# EAGLE design Schaltplan_SMD2 (EAGLE 8.2.2)
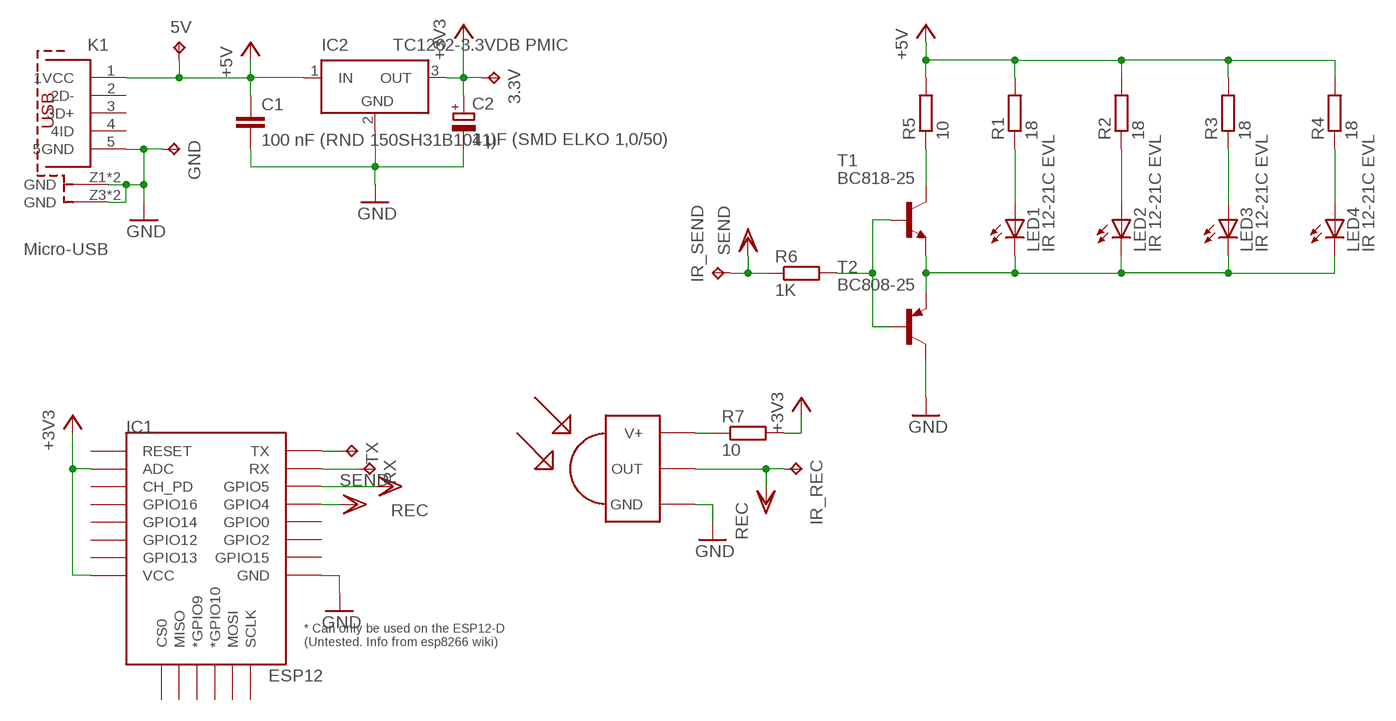
[diagram p0: schematic, sheet 1]

## Parts
3.3V  TPB2,54  [B2,54]
5V  TPB2,54  [B2,54]
C1  100 nF (RND 150SH31B1041)  C-EUC1206  [C1206]
C2  1 µF (SMD ELKO 1,0/50)  CPOL-EUUD-4X5,8  [UD-4X5,8_NICHICON]
GND  TPB2,54  [B2,54]
IC1  ESP12  ESP12ESMD  [ESP12E-SMD]
IC2  TC1262-3.3VDB PMIC  LT1129CST5  [SOT223]
IR-TRANSMITTER  TSOP1833  [TSOP18XX]
IR_REC  TPB2,54  [B2,54]
IR_SEND  TPB2,54  [B2,54]
K1  Micro-USB  629105150521  [629105150521]
LED1  IR 12-21C EVL  LEDCHIPLED_1206  [CHIPLED_1206]
LED2  IR 12-21C EVL  LEDCHIPLED_1206  [CHIPLED_1206]
LED3  IR 12-21C EVL  LEDCHIPLED_1206  [CHIPLED_1206]
LED4  IR 12-21C EVL  LEDCHIPLED_1206  [CHIPLED_1206]
R1  18  R-EU_R1206W  [R1206W]
R2  18  R-EU_R1206W  [R1206W]
R3  18  R-EU_R1206W  [R1206W]
R4  18  R-EU_R1206W  [R1206W]
R5  10  R-EU_R1206W  [R1206W]
R6  1K  R-EU_R1206W  [R1206W]
R7  10  R-EU_R1206W  [R1206W]
RX  TPB2,54  [B2,54]
T1  BC818-25  BC818-25SMD  [SOT23-BEC]
T2  BC808-25  BC808-25SMD  [SOT23-BEC]
TX  TPB2,54  [B2,54]

## Nets
+3V3: 3.3V.TP C2.+ IC1.ADC IC1.VCC IC2.3(OUT) R7.2
+3V3T: IR-TRANSMITTER.VCC(V+) R7.1
+5V: 5V.TP C1.1 IC2.1(IN) K1.1(1VCC) R1.2 R2.2 R3.2 R4.2 R5.2
+5VT1: LED1.A R1.1
+5VT2: LED2.A R2.1
+5VT3: LED3.A R3.1
+5VT4: LED4.A R4.1
+5VT5: R5.1 T1.C
GND: C1.2 C2.- GND.TP IC1.GND IC2.2(GND) IR-TRANSMITTER.GND K1.5(5GND) K1.Z1(GND) K1.Z2(GND) K1.Z3(GND) K1.Z4(GND) T2.C
IR_REC: IC1.GPIO5 IR-TRANSMITTER.OUT IR_REC.TP ; supply symbol labelled REC
IR_SEND: IC1.GPIO4 IR_SEND.TP R6.1 ; supply symbol labelled SEND
N$2: R6.2 T1.B T2.B
RX: IC1.RXD0(RX) RX.TP
SWITCHED: LED1.C LED2.C LED3.C LED4.C T1.E T2.E
TX: IC1.TXD0(TX) TX.TP
Unconnected: IC1.CH_PD IC1.CS0 IC1.GPIO0 IC1.GPIO2 IC1.GPIO9(*GPIO9) IC1.GPIO10(*GPIO10) IC1.GPIO12 IC1.GPIO13 IC1.GPIO14 IC1.GPIO15 IC1.GPIO16 IC1.MISO IC1.MOSI IC1.RESET IC1.SCLK K1.2(2D-) K1.3(3D+) K1.4(4ID)

## Power pins joined to a net without a drawn wire
GND: IC2.4(GND)

## Library data of the parts
3.3V 5V GND IR_REC IR_SEND RX TX = testpad:TP: Test pad
C1 = rcl:C-EU: CAPACITOR, European symbol
C2 = rcl:CPOL-EU: POLARIZED CAPACITOR, European symbol
IC1 = esp8266modules:ESP12E: ESP12E Module
IC2 = linear-technology:LT1129CST5: VOLTAGE REGULATOR with shutdown; MPN: LT1129CST-5#PBF; OC_FARNELL: 1663375; OC_NEWARK: 57M2069
IR-TRANSMITTER = tsop:TSOP1833: IR Receiver and Demodulator
K1 = Wurth_Elektronik_Electromechanic_Input-Output_Connectors_rev15c:629105150521: WR-COM_USB_Micro Type B_Horizontal_SMT ; Micro Type B Horizontal SMT - 3A current at Pin1 & Pin 5 - with Pegs and THT shielding Pins - T&R Packaging Code : Con_I-O_COM_USB_2.0_B_629105150521_629105150521 <http://katalog.we-online.de/media/images/eican/Con_I-O_COM_USB_2.0_B_629105150521_pf2.jpg> Details see: http://katalog.we-online.de/em/datasheet/629105150521.pdf Created 12/08/2014, Dan Xu 2014 (C) Wurth Elektronik
LED1-LED4 = led:LED: LED OSRAM: - CHIPLED LG R971, LG N971, LY N971, LG Q971, LY Q971, LO R971, LY R971 LH N974, LH R974 LS Q976, LO Q976, LY Q976 LO Q996 - Hyper CHIPLED LW Q18S LB Q993, LB Q99A, LB R99A - SideLED LS A670, LO A670, LY A670, LG A670, LP A670 LB A673, LV A673, LT A673, LW A673 LH A674 LY A675 LS A676, LA A676, LO A676, LY A676, LW A676 LS A679, LY A679, LG A679 - Hyper Micro SIDELED® LS Y876, LA Y876, LO Y876, LY Y876 LT Y87S - SmartLED LW L88C, LW L88S LB L89C, LB L89S, LG L890 LS L89K, LO L89K, LY L89K LS L896, LA L896, LO L896, LY L896 - TOPLED LS T670, LO T670, LY T670, LG T670, LP T670 LSG T670, LSP T670, LSY T670, LOP T670, LYG T670 LG T671, LOG T671, LSG T671 LB T673, LV T673, LT T673, LW T673 LH T674 LS T676, LA T676, LO T676, LY T676, LB T676, LH T676, LSB T676, LW T676 LB T67C, LV T67C, LT T67C, LS T67K, LO T67K, LY T67K, LW E67C LS E67B, LA E67B, LO E67B, LY E67B, LB E67C, LV E67C, LT E67C LW T67C LS T679, LY T679, LG T679 LS T770, LO T770, LY T770, LG T770, LP T770 LB T773, LV T773, LT T773, LW T773 LH T774 LS E675, LA E675, LY E675, LS T675 LS T776, LA T776, LO T776, LY T776, LB T776 LHGB T686 LT T68C, LB T68C - Hyper Mini TOPLED® LB M676 - Mini TOPLED Santana® LG M470 LS M47K, LO M47K, LY M47K Source: http://www.osram.convergy.de LUXEON: - LUMILED® LXK2-PW12-R00, LXK2-PW12-S00, LXK2-PW14-U00, LXK2-PW14-V00 LXK2-PM12-R00, LXK2-PM12-S00, LXK2-PM14-U00 LXK2-PE12-Q00, LXK2-PE12-R00, LXK2-PE12-S00, LXK2-PE14-T00, LXK2-PE14-U00 LXK2-PB12-K00, LXK2-PB12-L00, LXK2-PB12-M00, LXK2-PB14-N00, LXK2-PB14-P00, LXK2-PB14-Q00 LXK2-PR12-L00, LXK2-PR12-M00, LXK2-PR14-Q00, LXK2-PR14-R00 LXK2-PD12-Q00, LXK2-PD12-R00, LXK2-PD12-S00 LXK2-PH12-R00, LXK2-PH12-S00 LXK2-PL12-P00, LXK2-PL12-Q00, LXK2-PL12-R00 Source: www.luxeon.com KINGBRIGHT: KA-3528ASYC Source: www.kingbright.com
R1-R7 = resistor:R-EU_: RESISTOR, European symbol
T1 = transistor-npn:BC818*: NPN Transistor
T2 = transistor-pnp:BC808*: PNP Transistror

## Board
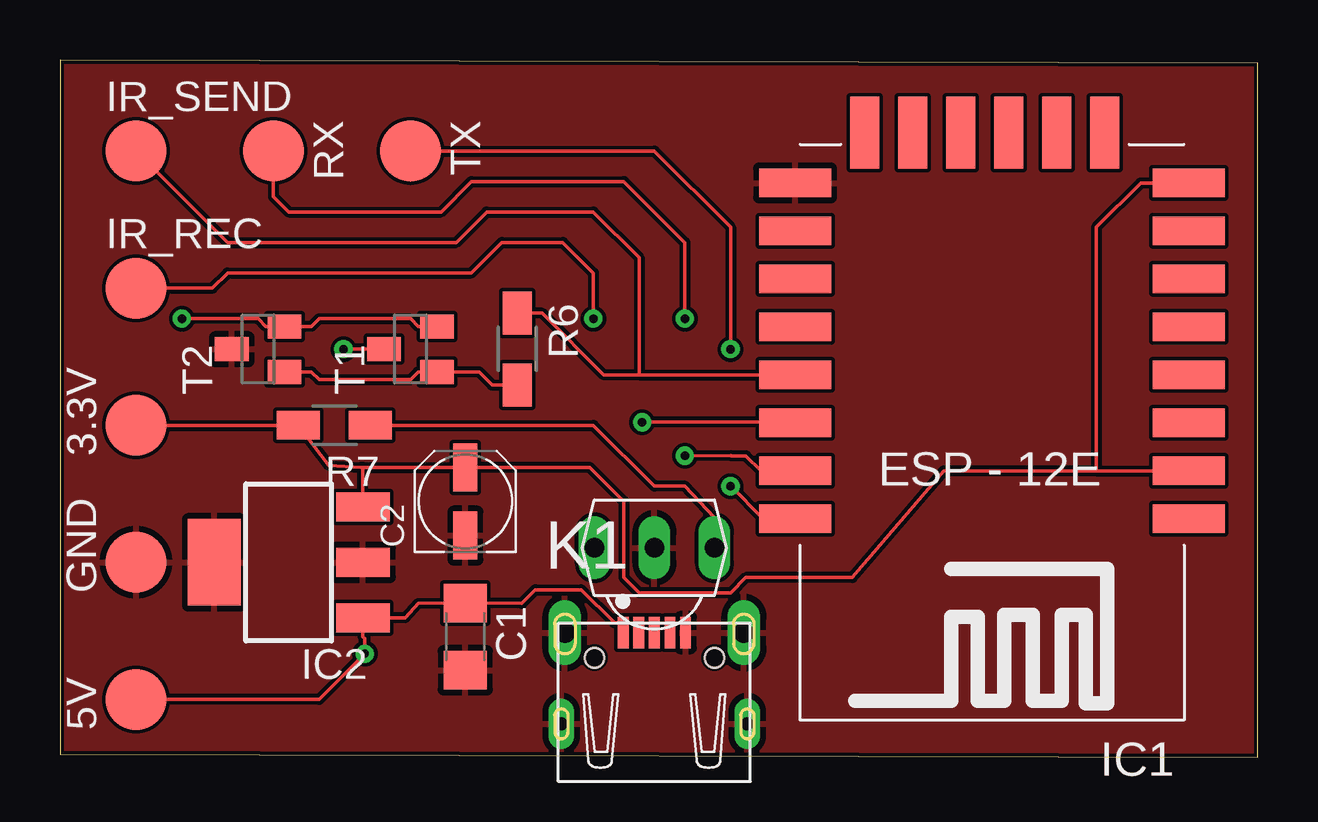
[diagram p1: board, top side]
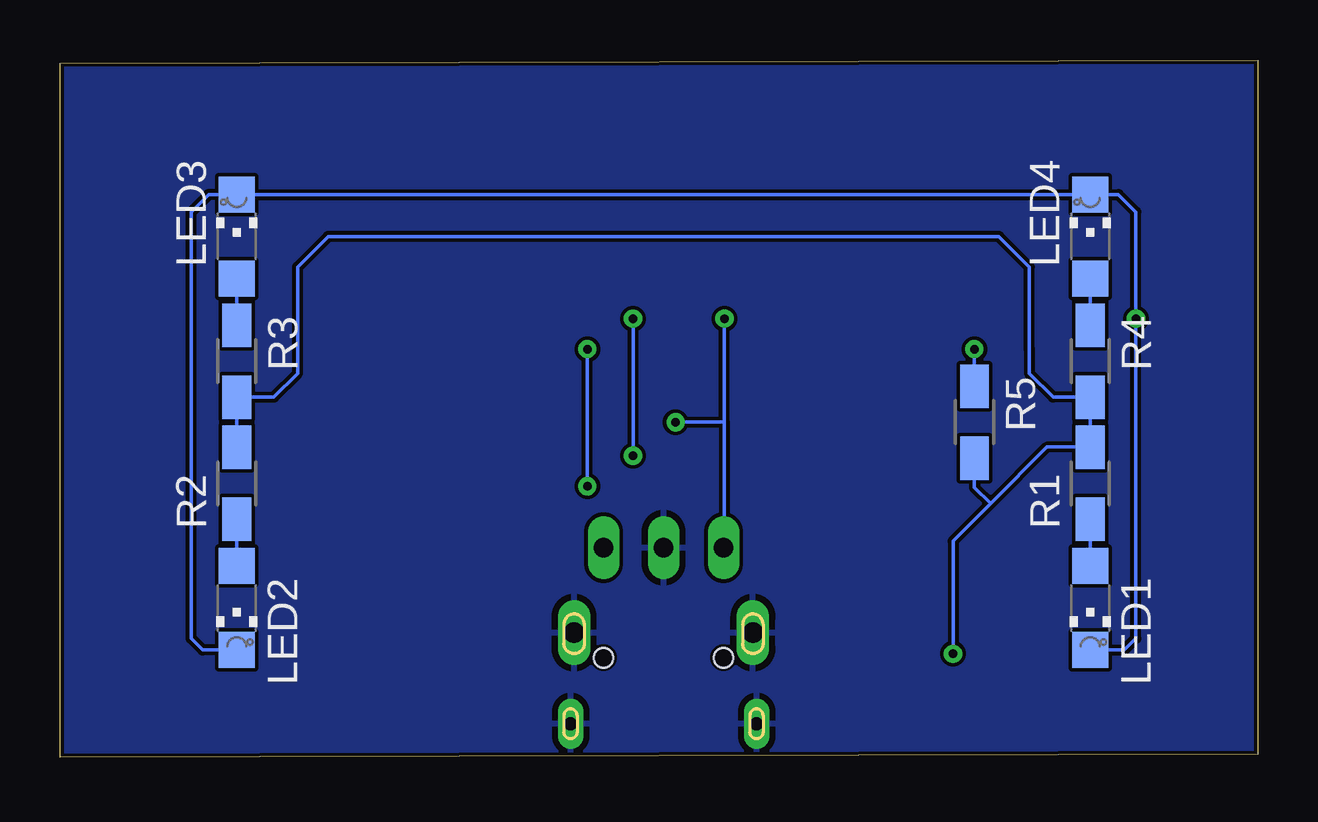
[diagram p2: board, bottom side, seen from below]

Size 49.91 x 29.07 mm. Coordinates in mm from the lower left corner, seen from the top.
Outline: 0,0.13 49.91,0 49.91,28.95 0,29.07 0,0.13
Copper layers (1*16): Top 0.035mm / dielectric 1.5mm / Bottom 0.035mm
Design rules "default *": minimum track width 6mil, minimum drill 0.35mm, track to track 6mil, track to pad 6mil, pad to pad 6mil, via to via 6mil, smd to smd 6mil, copper to edge 6mil, drill to drill 6mil, minimum pad ring 10mil, minimum via ring 8mil, stop-mask expansion 4mil, vias tented up to drill 0mil, thermal gap 10mil

### Footprints (pad centres in the part's own frame; a part is rotated, then mirrored left to right if it is on the bottom)
B2,54 = smd 2.54 x 2.54: TP 0,0
C1206 = smd 1.6 x 1.8: 1 -1.4,0; 2 1.4,0
UD-4X5,8_NICHICON = smd 2 x 1: + 1.425,0; - -1.425,0
ESP12E-SMD = smd 3 x 1.2: ADC -8.3,3.8; CH_PD -8.3,1.8; GND 8.1,-8.2; GPIO0 8.1,-2.2; GPIO2 8.1,-4.2; GPIO4 8.1,-0.2; GPIO5 8.1,1.8; GPIO12 -8.3,-4.2; GPIO13 -8.3,-6.2; GPIO14 -8.3,-2.2; GPIO15 8.1,-6.2; GPIO16 -8.3,-0.2; RESET -8.3,5.8; RXD0 8.1,3.8; TXD0 8.1,5.8; VCC -8.3,-8.2 | smd 1.2 x 3: CS0 -4.8,-10.3; GPIO9 -0.8,-10.3; GPIO10 1.2,-10.3; MISO -2.8,-10.3; MOSI 3.2,-10.3; SCLK 5.2,-10.3
SOT223 = smd 1.219 x 2.235: 1 -2.311,-3.099; 2 0,-3.099; 3 2.311,-3.099 | smd 3.6 x 2.2: 4 0,3.099
TSOP18XX = drill 0.813 long: GND -0.001,-0.027; OUT -2.501,-0.027; VCC 2.499,-0.027
629105150521 = smd 0.45 x 1.3: 1 -1.3,3.8; 2 -0.65,3.8; 3 0,3.8; 4 0.65,3.8; 5 1.3,3.8 | drill 0.85 pad 1.2 long: Z1 -3.725,3.8; Z2 3.725,3.8 | drill 0.55 pad 0.9 long: Z3 3.875,0; Z4 -3.875,0 | hole 0.8: -2.5,2.75; 2.5,2.75
CHIPLED_1206 = smd 1.5 x 1.5: A 0,-1.75; C 0,1.75
R1206W = smd 1.8 x 1.2: 1 -1.499,0; 2 1.499,0
SOT23-BEC = smd 1 x 1.4: B -0.95,-1.1; C 0,1.1; E 0.95,-1.1

### Placement (x,y rotation side)
3.3V  3.17,13.84 90 top
5V  3.17,2.41 90 top
C1  16.89,5.03 270 top
C2  16.89,10.67 90 top
GND  3.17,8.13 90 top
IC1  38.73,15.75 180 top
IC2  9.53,8.13 90 top
IR-TRANSMITTER  24.77,8.76 0 top
IR_REC  3.17,19.56 0 top
IR_SEND  3.17,25.27 0 top
K1  24.77,1.4 0 top
LED1  6.99,6.22 180 bottom
LED2  42.55,6.22 180 bottom
LED3  42.55,21.72 0 bottom
LED4  6.99,21.72 0 bottom
R1  6.99,11.43 90 bottom
R2  42.55,11.43 90 bottom
R3  42.55,16.51 270 bottom
R4  6.99,16.51 270 bottom
R5  11.81,13.97 270 bottom
R6  19.05,17.02 270 top
R7  11.43,13.84 180 top
RX  8.89,25.27 270 top
T1  14.61,17.02 90 top
T2  8.26,17.02 90 top
TX  14.61,25.27 270 top

### Tracks (layer width: path | path; a pad name or v marks a point on that pad's centre or on a via)
+3V3
  Top 0.152: IC1.VCC 45.03,23.95 43.18,22.1 43.18,11.94 | 43.18,11.94 IC1.ADC | 43.18,11.94 36.83,11.94 33.02,7.49 28.57,7.49 27.94,6.86 24.13,6.86 23.5,7.49 23.5,10.67 22.07,12.09 C2.+ 12.62,12.09 | 3.3V.TP R7.2 11.2,12.17 12.54,12.09 12.62,12.09 | IC2.3 12.62,12.09
+3V3T
  Top 0.152: IR-TRANSMITTER.VCC 27.26,9.99 26.04,11.3 24.77,11.3 22.23,13.84 R7.1
+5V  (via drill 0.35)
  Top 0.152: K1.1 23.5,5.42 23.5,5.59 23.08,5.62 21.72,6.98 19.81,6.98 19.24,6.41 C1.1 14.92,6.41 14.38,5.82 IC2.1 12.62,5.03 12.7,4.95 v12.7,4.32 10.79,2.41 5V.TP
  Bottom 0.152: R2.2 R3.2 41,15.01 40.01,16 40.01,20.45 38.73,21.72 10.79,21.72 9.53,20.45 9.53,17.02 | v12.7,4.32 12.7,9.02 11.14,10.58 | 11.14,10.58 8.79,12.93 R1.2 R4.2 8.53,15.01 9.53,16 9.53,17.02 | 9.53,17.02 | R5.2 11.81,11.25 11.14,10.58
+5VT1
  Bottom 0.152: LED1.A R1.1
+5VT2
  Bottom 0.152: LED2.A R2.1
+5VT3
  Bottom 0.152: LED3.A R3.1
+5VT4
  Bottom 0.152: LED4.A R4.1
+5VT5  (via drill 0.35)
  Top 0.152: T1.C v11.81,17.02
  Bottom 0.152: R5.1 v11.81,17.02
GND
  pour Top: 0,29.08 49.91,28.96 49.91,0 0,0.13
  pour Bottom: 0,29.08 49.91,28.96 49.91,0 0,0.13
IR_REC  (via drill 0.35)
  Top 0.152: IC1.GPIO5 29.32,13.95 29.08,13.97 v24.26,13.97 | IR_REC.TP 6.35,19.56 6.99,20.19 17.14,20.19 18.41,21.46 20.95,21.46 22.23,20.19 v22.23,18.29
  Bottom 0.152: 22.23,13.97 v22.23,18.29 | 22.23,13.97 22.23,8.78 IR-TRANSMITTER.OUT | v24.26,13.97 22.23,13.97
IR_SEND
  Top 0.152: IR_SEND.TP 6.99,21.46 16.51,21.46 17.78,22.73 22.23,22.73 24.13,20.83 24.13,15.95 | R6.1 20.09,18.52 22.66,15.95 24.13,15.95 | 24.13,15.95 IC1.GPIO4
N$2
  Top 0.152: R6.2 18.01,15.52 17.46,16.07 T1.B 14.93,16.07 14.61,15.75 10.79,15.75 10.47,16.07 T2.B
RX  (via drill 0.35)
  Top 0.152: v26.04,12.57 27.95,12.58 27.96,12.57 28.57,12.57 29.21,11.94 29.22,11.95 IC1.RXD0 | RX.TP 8.89,23.37 9.53,22.73 15.88,22.73 17.14,24 23.5,24 26.04,21.46 v26.04,18.29
  Bottom 0.152: v26.04,12.57 v26.04,18.29
SWITCHED  (via drill 0.35)
  Top 0.152: T1.E 14.93,17.97 14.61,18.29 10.79,18.29 10.47,17.97 T2.E 8.57,17.97 8.26,18.29 v5.08,18.29
  Bottom 0.152: LED2.C 43.97,4.47 44.45,4.95 44.45,22.73 43.72,23.47 LED3.C LED4.C 5.81,23.47 5.08,22.73 v5.08,18.29 5.08,4.95 5.56,4.47 LED1.C
TX  (via drill 0.35)
  Top 0.152: IC1.TXD0 29.3,9.95 v27.94,11.3 | TX.TP 24.77,25.27 27.94,22.1 v27.94,17.02
  Bottom 0.152: v27.94,11.3 v27.94,17.02